# Altium schematic sheet LedDisplay.SchDoc
size A4
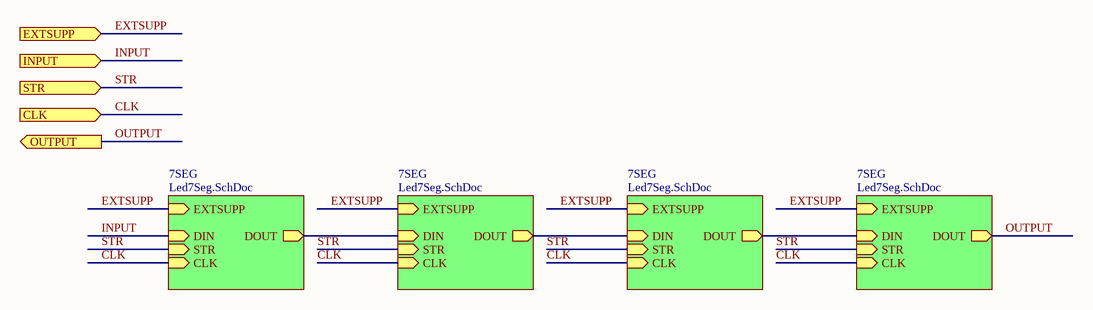
[diagram p0: LedDisplay.SchDoc]

## Sub-sheets
7SEG = Led7Seg.SchDoc: DIN (in), STR (in), CLK (in), DOUT (out), EXTSUPP (in)
7SEG = Led7Seg.SchDoc: DIN (in), STR (in), CLK (in), DOUT (out), EXTSUPP (in)
7SEG = Led7Seg.SchDoc: DIN (in), STR (in), CLK (in), DOUT (out), EXTSUPP (in)
7SEG = Led7Seg.SchDoc: DIN (in), STR (in), CLK (in), DOUT (out), EXTSUPP (in)

## Ports
CLK (in), EXTSUPP (in), INPUT (in), OUTPUT (out), STR (in)

## Nets
CLK: port CLK, sheet 7SEG/CLK, sheet 7SEG/CLK, sheet 7SEG/CLK, sheet 7SEG/CLK
EXTSUPP: port EXTSUPP, sheet 7SEG/EXTSUPP, sheet 7SEG/EXTSUPP, sheet 7SEG/EXTSUPP, sheet 7SEG/EXTSUPP
INPUT: port INPUT, sheet 7SEG/DIN
OUTPUT: port OUTPUT, sheet 7SEG/DOUT
STR: port STR, sheet 7SEG/STR, sheet 7SEG/STR, sheet 7SEG/STR, sheet 7SEG/STR
(unnamed): sheet 7SEG/DOUT, sheet 7SEG/DIN
(unnamed): sheet 7SEG/DOUT, sheet 7SEG/DIN
(unnamed): sheet 7SEG/DOUT, sheet 7SEG/DIN